# Altium schematic sheet Schematic4.SchDoc
size A4
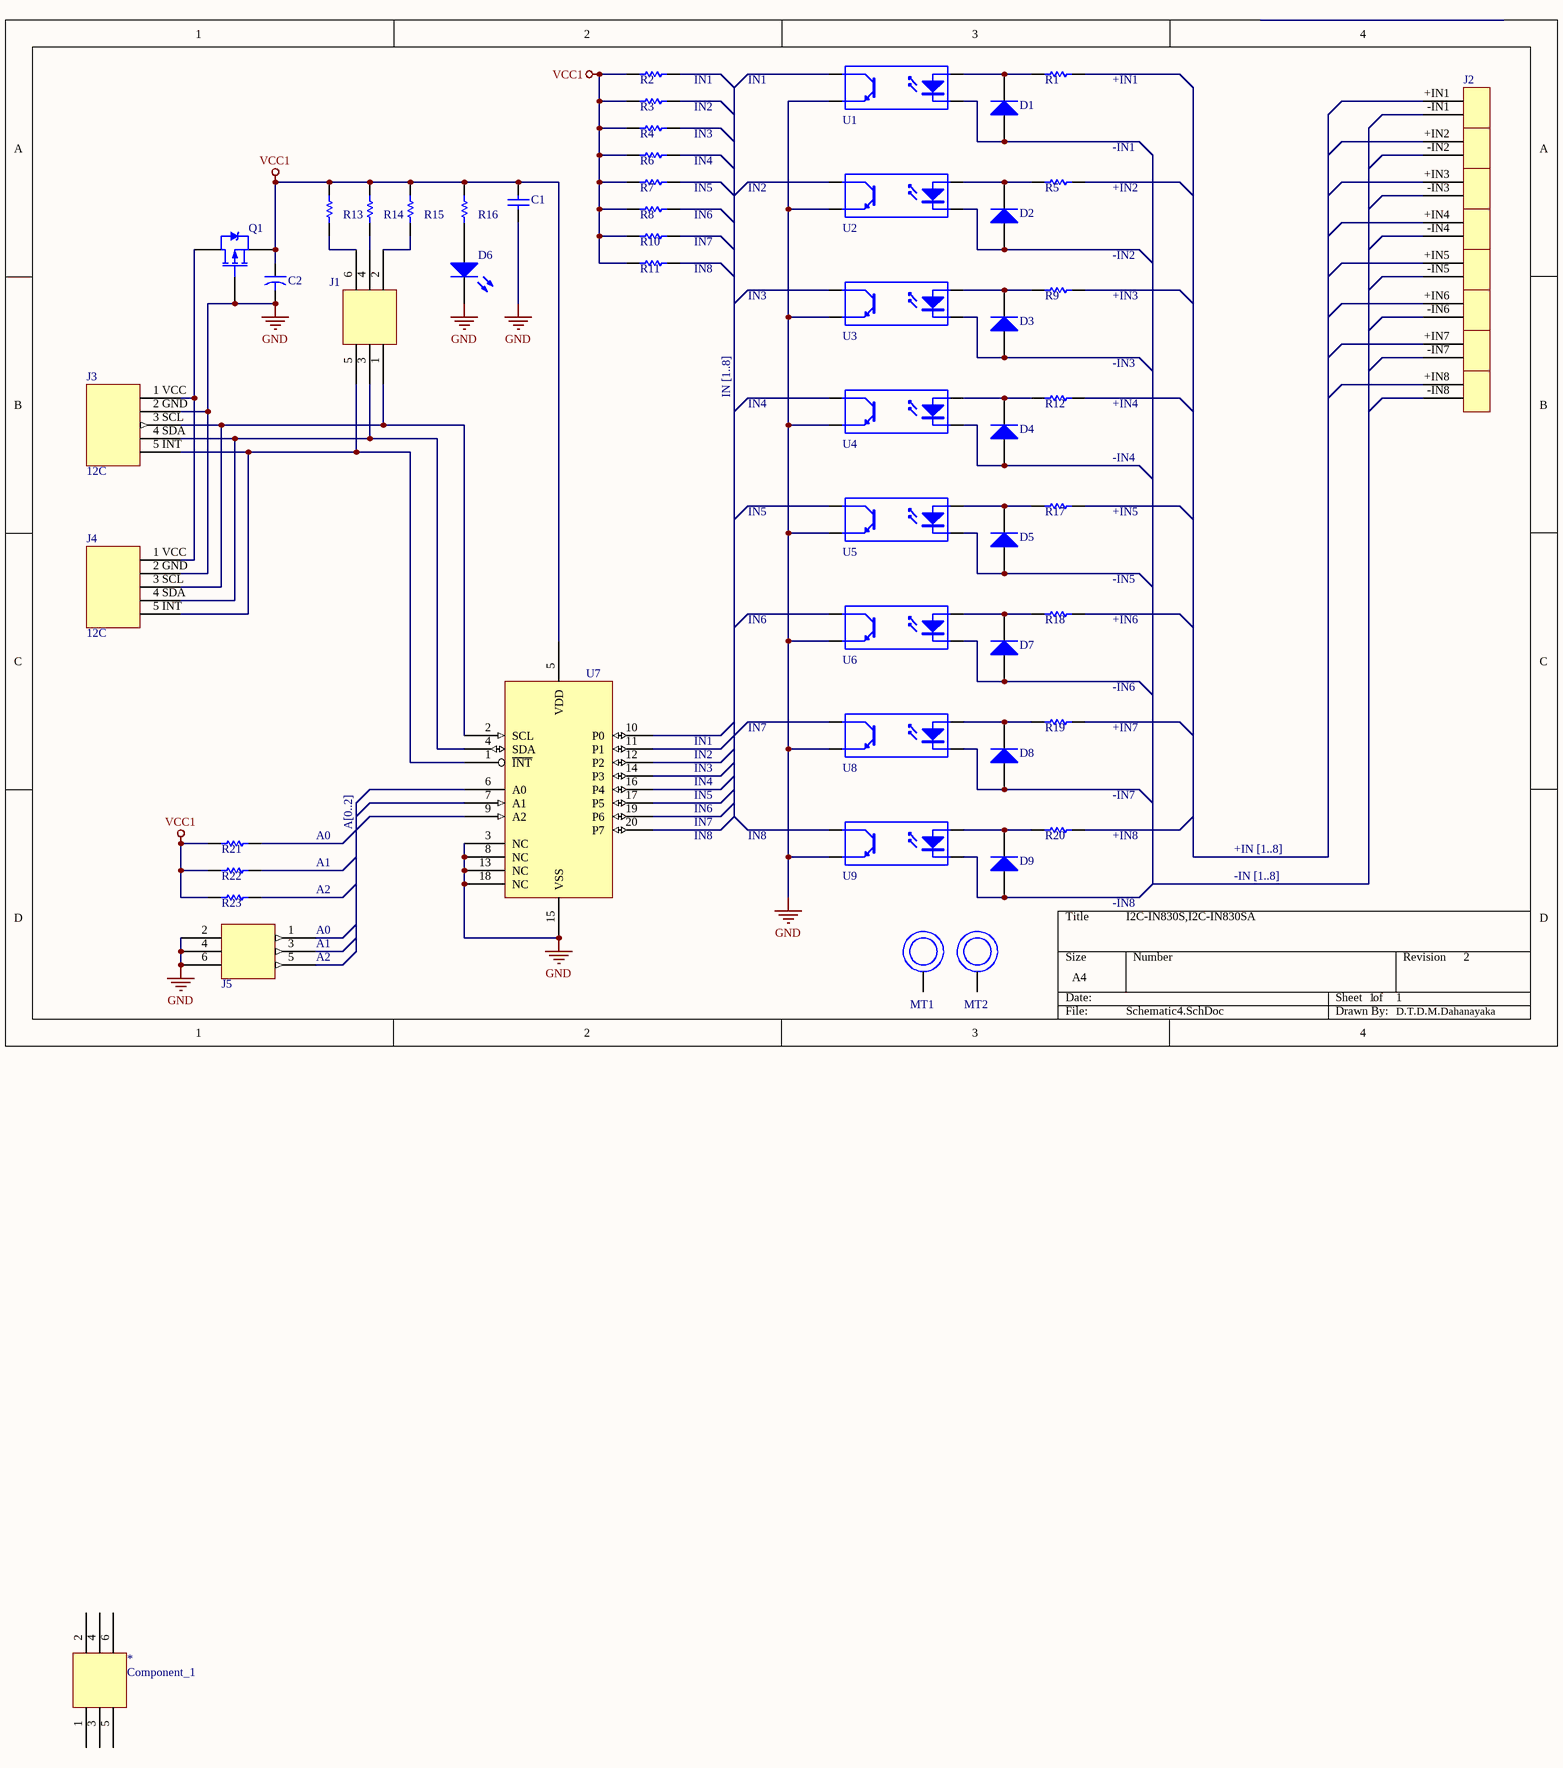
[diagram p0: Schematic4.SchDoc]

## Parts
*  Component_1
C1  Cap  [RAD-0.3]  (value not drawn)
C2  Cap2  [CAPR5-4X5]  (value not drawn)
D1  (no value)  [SOT-23_N]
D2  (no value)  [SOT-23_N]
D3  (no value)  [SOT-23_N]
D4  (no value)  [SOT-23_N]
D5  (no value)  [SOT-23_N]
D6  (no value)  [LED-0]
D7  (no value)  [SOT-23_N]
D8  (no value)  [SOT-23_N]
D9  (no value)  [SOT-23_N]
J1  (no value)
J2  (no value)
J3  12C
J4  12C
J5  (no value)
MT1  (no value)
MT2  (no value)
Q1  PMOS-2  [TO-220AB]  (value not drawn)
R1  Res1  [AXIAL-0.3]  (value not drawn)
R2  Res1  [AXIAL-0.3]  (value not drawn)
R3  Res1  [AXIAL-0.3]  (value not drawn)
R4  Res1  [AXIAL-0.3]  (value not drawn)
R5  Res1  [AXIAL-0.3]  (value not drawn)
R6  Res1  [AXIAL-0.3]  (value not drawn)
R7  Res1  [AXIAL-0.3]  (value not drawn)
R8  Res1  [AXIAL-0.3]  (value not drawn)
R9  Res1  [AXIAL-0.3]  (value not drawn)
R10  Res1  [AXIAL-0.3]  (value not drawn)
R11  Res1  [AXIAL-0.3]  (value not drawn)
R12  Res1  [AXIAL-0.3]  (value not drawn)
R13  Res1  [AXIAL-0.3]  (value not drawn)
R14  Res1  [AXIAL-0.3]  (value not drawn)
R15  Res1  [AXIAL-0.3]  (value not drawn)
R16  Res1  [AXIAL-0.3]  (value not drawn)
R17  Res1  [AXIAL-0.3]  (value not drawn)
R18  Res1  [AXIAL-0.3]  (value not drawn)
R19  Res1  [AXIAL-0.3]  (value not drawn)
R20  Res1  [AXIAL-0.3]  (value not drawn)
R21  Res1  [AXIAL-0.3]  (value not drawn)
R22  Res1  [AXIAL-0.3]  (value not drawn)
R23  Res1  [AXIAL-0.3]  (value not drawn)
U1  (no value)  [DIP-4]
U2  (no value)  [DIP-4]
U3  (no value)  [DIP-4]
U4  (no value)  [DIP-4]
U5  (no value)  [DIP-4]
U6  (no value)  [DIP-4]
U7  (no value)
U8  (no value)  [DIP-4]
U9  (no value)  [DIP-4]

## Nets
GND: C1.1 C2.2 D6.2(K) J3.2_GND J4.2_GND J5.2 J5.4 J5.6 Q1.1(G) U1.3(E) U2.3(E) U3.3(E) U4.3(E) U5.3(E) U6.3(E) U7.3(NC) U7.8(NC) U7.13(NC) U7.15(VSS) U7.18(NC) U8.3(E) U9.3(E)
VCC1: C1.2 C2.1 Q1.3(S) R2.1 R3.1 R4.1 R6.1 R7.1 R8.1 R10.1 R11.1 R13.2 R14.2 R15.2 R16.2 R21.2 R22.2 R23.2 U7.5(VDD)
NetD1_1: D1.1(A) U1.2(K)
NetD1_3: D1.3(K) R1.1 U1.1(A)
NetD2_1: D2.1(A) U2.2(K)
NetD2_3: D2.3(K) R5.1 U2.1(A)
NetD3_1: D3.1(A) U3.2(K)
NetD3_3: D3.3(K) R9.1 U3.1(A)
NetD4_1: D4.1(A) U4.2(K)
NetD4_3: D4.3(K) R12.1 U4.1(A)
NetD5_1: D5.1(A) U5.2(K)
NetD5_3: D5.3(K) R17.1 U5.1(A)
NetD6_1: D6.1(A) R16.1
NetD7_1: D7.1(A) U6.2(K)
NetD7_3: D7.3(K) R18.1 U6.1(A)
NetD8_1: D8.1(A) U8.2(K)
NetD8_3: D8.3(K) R19.1 U8.1(A)
NetD9_1: D9.1(A) U9.2(K)
NetD9_3: D9.3(K) R20.1 U9.1(A)
NetJ1_1: J1.1 J3.3_SCL J4.3_SCL U7.2(SCL)
NetJ1_2: J1.2 R15.1
NetJ1_3: J1.3 J3.4_SDA J4.4_SDA U7.4(SDA)
NetJ1_4: J1.4 R14.1
NetJ1_5: J1.5 J3.5_INT J4.5_INT U7.1(~{INT})
NetJ1_6: J1.6 R13.1
NetJ3_1 VCC: J3.1_VCC J4.1_VCC Q1.2(D)

Not connected (* = marked no-connect by the designer): * 1 2 3 4 5 6; J2 +IN1 +IN2 +IN3 +IN4 +IN5 +IN6 +IN7 +IN8 -IN1 -IN2 -IN3 -IN4 -IN5 -IN6 -IN7 -IN8; J5 1 3 5; MT1 ?1; MT2 ?1; R1 2; R2 2; R3 2; R4 2; R5 2; R6 2; R7 2; R8 2; R9 2; R10 2; R11 2; R12 2; R17 2; R18 2; R19 2; R20 2; R21 1; R22 1; R23 1; U1 4(C); U2 4(C); U3 4(C); U4 4(C); U5 4(C); U6 4(C); U7 6(A0) 7(A1) 9(A2) 10(P0) 11(P1) 12(P2) 14(P3) 16(P4) 17(P5) 19(P6) 20(P7); U8 4(C); U9 4(C)

## Notes on the sheet
- IN1
- IN2
- (near R1) +IN1
- IN3
- IN4
- IN5
- (near R5) -IN1
- (near R5) +IN2
- IN6
- IN7
- (near R9) -IN2
- IN8
- (near R9) +IN3
- IN [1..8]
- (near R12) -IN3
- -IN4
- (near R12) +IN4
- (near R17) +IN5
- (near R18) -IN5
- (near R18) +IN6
- (near R19) -IN6
- (near R19) +IN7
- (near R20) -IN7
- A0
- A1
- A[0..2]
- (near R20) +IN8
- +IN [1..8]
- A2
- (near J5) A0
- -IN8
- I2C-IN830S,I2C-IN830SA
- -IN [1..8]
- (near J5) A1
- (near J5) A2
- 1
- 2
- D.T.D.M.Dahanayaka

## Library data of the parts
C1 = Cap: Capacitor; Published: 8-Jun-2000; LatestRevisionDate: 17-Jul-2002; LatestRevisionNote: Re-released for DXP Platform.; PackageReference: RAD-0.3; Publisher: Altium Limited; PackageDescription: Radial Cap, Thru-Hole; 2 Leads; 0.3 in Pin Spacing
C2 = Cap2: Capacitor; Value: 100pF; Published: 23-Sep-2002; PackageReference: CAPR5-4X5; Publisher: Altium Limited; PackageDescription: Capacitor; 2 Leads
D1-D5 D7-D9 = Diode BAS116: Silicon Low Leakage Diode; Note: Pin 2 is not connected and not drawn.; Published: 21-Mar-2003; LatestRevisionDate: 29-May-2009; LatestRevisionNote: IPC-7351 Footprint Added.; DatasheetVersion: Oct-1999; PackageVersion: Sep-2001; PackageReference: SOT-23; Publisher: Altium Limited; PackageDescription: 3-Pin SOT-23 Package 0.95 mm Pitch, 2.5 mm Lead Span; ComponentLink1Description: Manufacturer Link; ComponentLink1URL: http://www.infineon.com/; ComponentLink2Description: Datasheet; ComponentLink2URL: http://www.infineon.com/upload/Document/cmc_upload/documents/080/656/bas116series.pdf
D6 = LED0: Typical INFRARED GaAs LED; Published: 8-Jun-2000; LatestRevisionDate: 08-Jul-2005; LatestRevisionNote: Mech Layer 1 removed.; PackageReference: LED-0; Publisher: Altium Limited; PackageDescription: LED; 2 Leads
J1-J5 MT1 MT2 U7 = Component_1
Q1 = PMOS-2: P-Channel Power MOSFET; Note: Pin 4 not drawn and electrically connected to Pin 2.; Published: 8-Jun-2000; LatestRevisionDate: 17-Jul-2002; LatestRevisionNote: Re-released for DXP Platform.; DatasheetVersion: PD-9.390D; PackageVersion: Feb-1997; PackageReference: TO-220AB; Publisher: Altium Limited; PackageDescription: TO, Thru-Hole, Vertical, Heatsink Mounted; 3 In-Line Leads; Pitch 2.54 mm; ComponentLink1Description: Manufacturer Link; ComponentLink1URL: http://www.irf.com/
R1-R23 = Res1: Resistor; Published: 8-Jun-2000; LatestRevisionDate: 17-Jul-2002; LatestRevisionNote: Re-released for DXP Platform.; PackageReference: AXIAL-0.3; Publisher: Altium Limited; PackageDescription: Axial Device, Thru-Hole; 2 Leads; 0.3 in Pin Spacing
U1-U6 U8 U9 = Optoisolator1: 4-Pin Phototransistor Optocoupler; Published: 24-Mar-1999; LatestRevisionDate: 04-Mar-2005; LatestRevisionNote: Sch pins 3 & 4 Swapped.; DatasheetVersion: Nov-2003; PackageReference: DIP-4; Publisher: Altium Limited